# EasyEDA schematic RocketPDBV4.json
TITLE: Sheet_1; REV: 1.0; Date: 2025-03-01; Sheet: 1/1; Company: Your Company
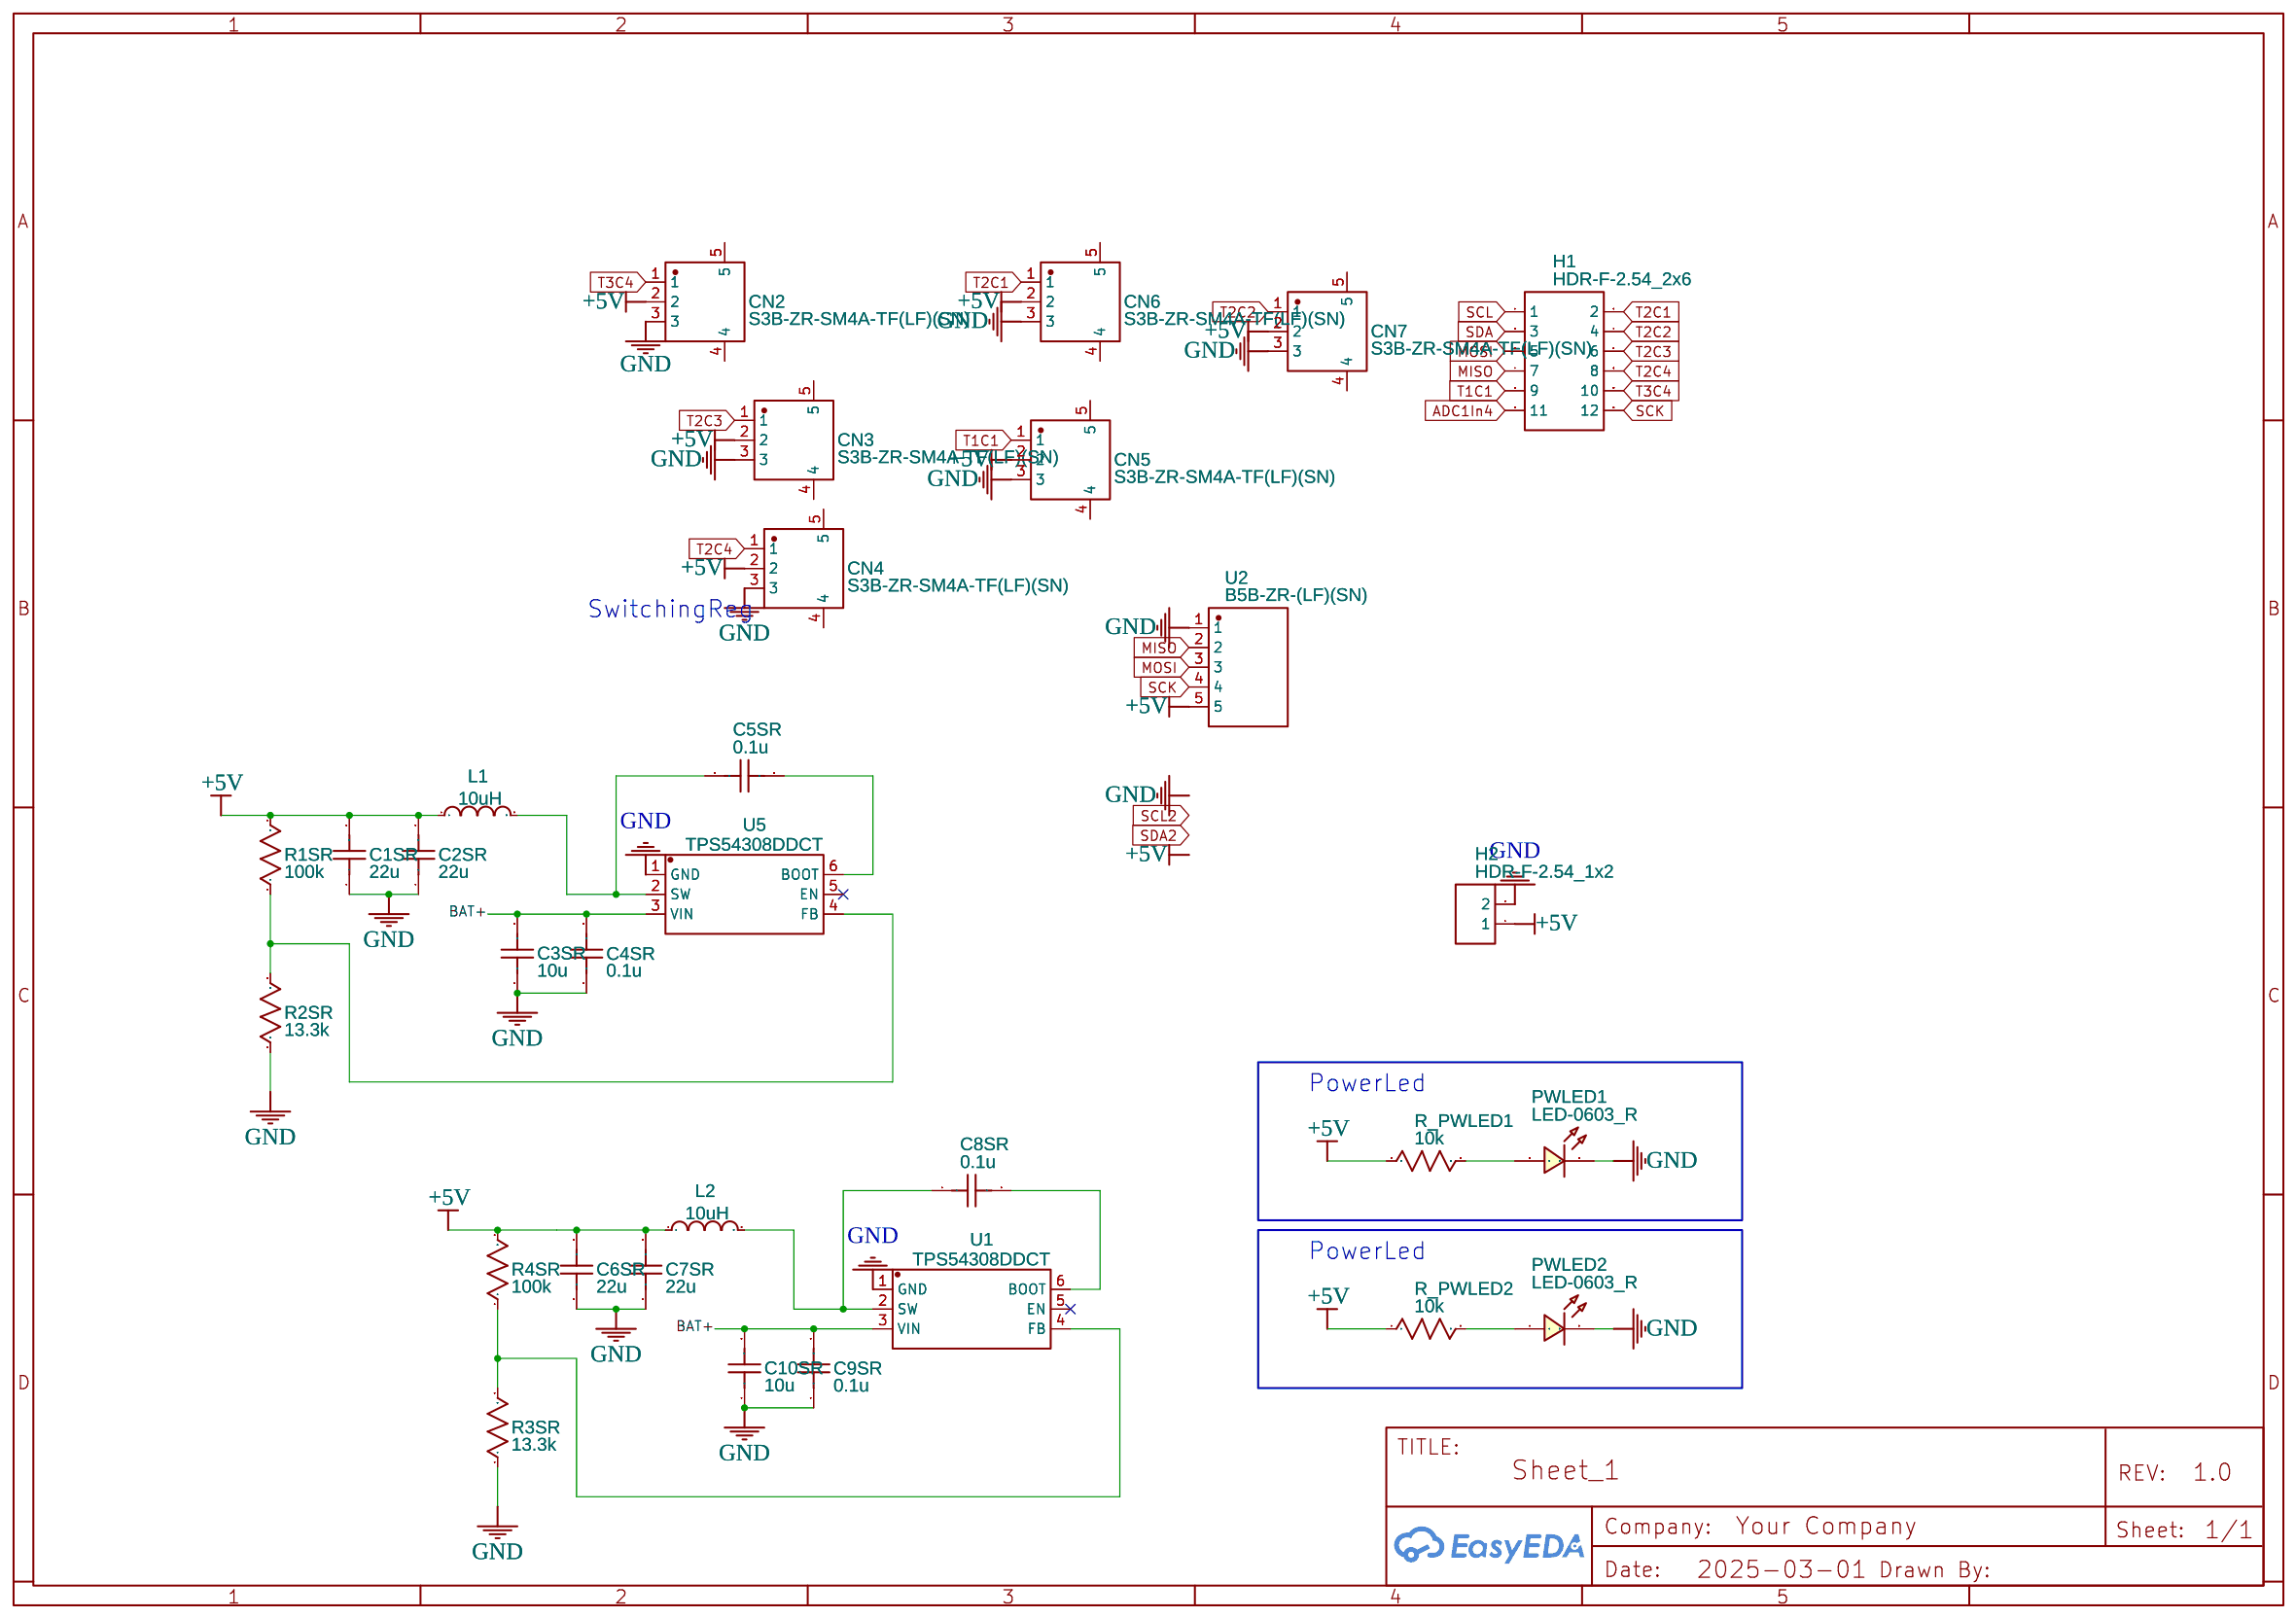
[diagram p0: schematic sheet]

## Parts
C1SR  22u  [C0805]
C2SR  22u  [C0805]
C3SR  10u  [C0805]
C4SR  0.1u  [C0805]
C5SR  0.1u  [C0805]
C6SR  22u  [C0805]
C7SR  22u  [C0805]
C8SR  0.1u  [C0805]
C9SR  0.1u  [C0805]
C10SR  10u  [C0805]
CN2  S3B-ZR-SM4A-TF(LF)(SN)  [CONN-TH_S3B-ZR-SM4A-TF-LF-SN]
CN3  S3B-ZR-SM4A-TF(LF)(SN)  [CONN-TH_S3B-ZR-SM4A-TF-LF-SN]
CN4  S3B-ZR-SM4A-TF(LF)(SN)  [CONN-TH_S3B-ZR-SM4A-TF-LF-SN]
CN5  S3B-ZR-SM4A-TF(LF)(SN)  [CONN-TH_S3B-ZR-SM4A-TF-LF-SN]
CN6  S3B-ZR-SM4A-TF(LF)(SN)  [CONN-TH_S3B-ZR-SM4A-TF-LF-SN]
CN7  S3B-ZR-SM4A-TF(LF)(SN)  [CONN-TH_S3B-ZR-SM4A-TF-LF-SN]
H1  HDR-F-2.54_2x6  [HDR-F-2.54_2X6]
H2  HDR-F-2.54_1x2  [HDR-F-2.54_1X2]
L1  10uH  [L1210]
L2  10uH  [L1210]
PWLED1  LED-0603_R  [LED0603_RED]
PWLED2  LED-0603_R  [LED0603_RED]
R1SR  100k  [R0603]
R2SR  13.3k  [R0603]
R3SR  13.3k  [R0603]
R4SR  100k  [R0603]
R_PWLED1  10k  [R0603]
R_PWLED2  10k  [R0603]
U1  TPS54308DDCT  [TSOT-23-6_L2.9-W1.6-P0.95-LS2.8-BR]
U2  B5B-ZR-(LF)(SN)  [CONN-TH_5P-P1.50_B5B-ZR-LF-SN]
U5  TPS54308DDCT  [TSOT-23-6_L2.9-W1.6-P0.95-LS2.8-BR]

## Library data of the parts
C1SR C2SR C3SR C4SR C5SR C6SR C7SR C8SR C9SR C10SR = C_0603_US: Contributor: LCEDA_Lib
CN2-CN7 = S3B-ZR-SM4A-TF(LF)(SN): Contributor: LCSC; Supplier: LCSC; Supplier Part: C72591; Manufacturer: JST; JLCPCB Part Class: Extended Part
H1 = HDR-F-2.54_2x6: Supplier Part: C36191; Supplier: LCSC; Contributor: LCEDA_Lib
H2 = HDR-F-2.54_1x2: Supplier Part: C49661; Supplier: LCSC; Contributor: LCEDA_Lib
L1 L2 = L0603_US: Contributor: LCEDA_Lib
PWLED1 PWLED2 = LED-0603_R: Manufacturer: EVERLIGHT(台湾亿光); Manufacturer Part: 19-217/R6C-AL1M2VY/3T; Supplier Part: C72044; Supplier: LCSC; Contributor: LCEDA_01
R1SR R2SR R3SR R4SR R_PWLED1 R_PWLED2 = R_0603_US: Contributor: LCEDA_Lib
U1 U5 = TPS54308DDCT: Contributor: LCSC; Supplier: LCSC; Supplier Part: C2071054; Manufacturer: TI(德州仪器); JLCPCB Part Class: Extended Part
U2 = B5B-ZR-(LF)(SN): Contributor: LCSC; Supplier: LCSC; Supplier Part: C157990; Manufacturer: JST; Manufacturer Part: B5B-ZR(LF)(SN); JLCPCB Part Class: Extended Part

## Nets
+5V: C1SR.2 C2SR.2 C6SR.2 C7SR.2 CN2.2 CN3.2 CN4.2 CN5.2 CN6.2 CN7.2 H2.1 L1.1 L2.1 R1SR.2 R4SR.2 R_PWLED1.1 R_PWLED2.1 U2.5
GND: C1SR.1 C2SR.1 C3SR.1 C4SR.1 C6SR.1 C7SR.1 C9SR.1 C10SR.1 CN2.3 CN3.3 CN4.3 CN5.3 CN6.3 CN7.3 H2.2 PWLED1.2 PWLED2.2 R2SR.1 R3SR.1 U1.1(GND) U2.1 U5.1(GND)
ADC1In4: H1.11
BAT+: C3SR.2 C4SR.2 C9SR.2 C10SR.2 U1.3(VIN) U5.3(VIN)
MISO: H1.7 U2.2
MOSI: H1.5 U2.3
SCK: H1.12 U2.4
SCL: H1.1
SDA: H1.3
T1C1: CN5.1 H1.9
T2C1: CN6.1 H1.2
T2C2: CN7.1 H1.4
T2C3: CN3.1 H1.6
T2C4: CN4.1 H1.8
T3C4: CN2.1 H1.10
Net-(C5SR-1): C5SR.1 L1.2 U5.2(SW)
Net-(C5SR-2): C5SR.2 U5.6(BOOT)
Net-(C8SR-1): C8SR.1 L2.2 U1.2(SW)
Net-(C8SR-2): C8SR.2 U1.6(BOOT)
Net-(PWLED1-1): PWLED1.1 R_PWLED1.2
Net-(PWLED2-1): PWLED2.1 R_PWLED2.2
Net-(R1SR-1): R1SR.1 R2SR.2 U5.4(FB)
Net-(R3SR-2): R3SR.2 R4SR.1 U1.4(FB)

Not connected (* = marked no-connect by the designer): CN2 4 5; CN3 4 5; CN4 4 5; CN5 4 5; CN6 4 5; CN7 4 5; U1 5(EN)*; U5 5(EN)*

## Notes on the sheet
- SwitchingReg
- PowerLed
- PowerLed
